# EasyEDA Pro project _SHA-PCB V1.1  30 23_2024-08-26.epro, board PCB1
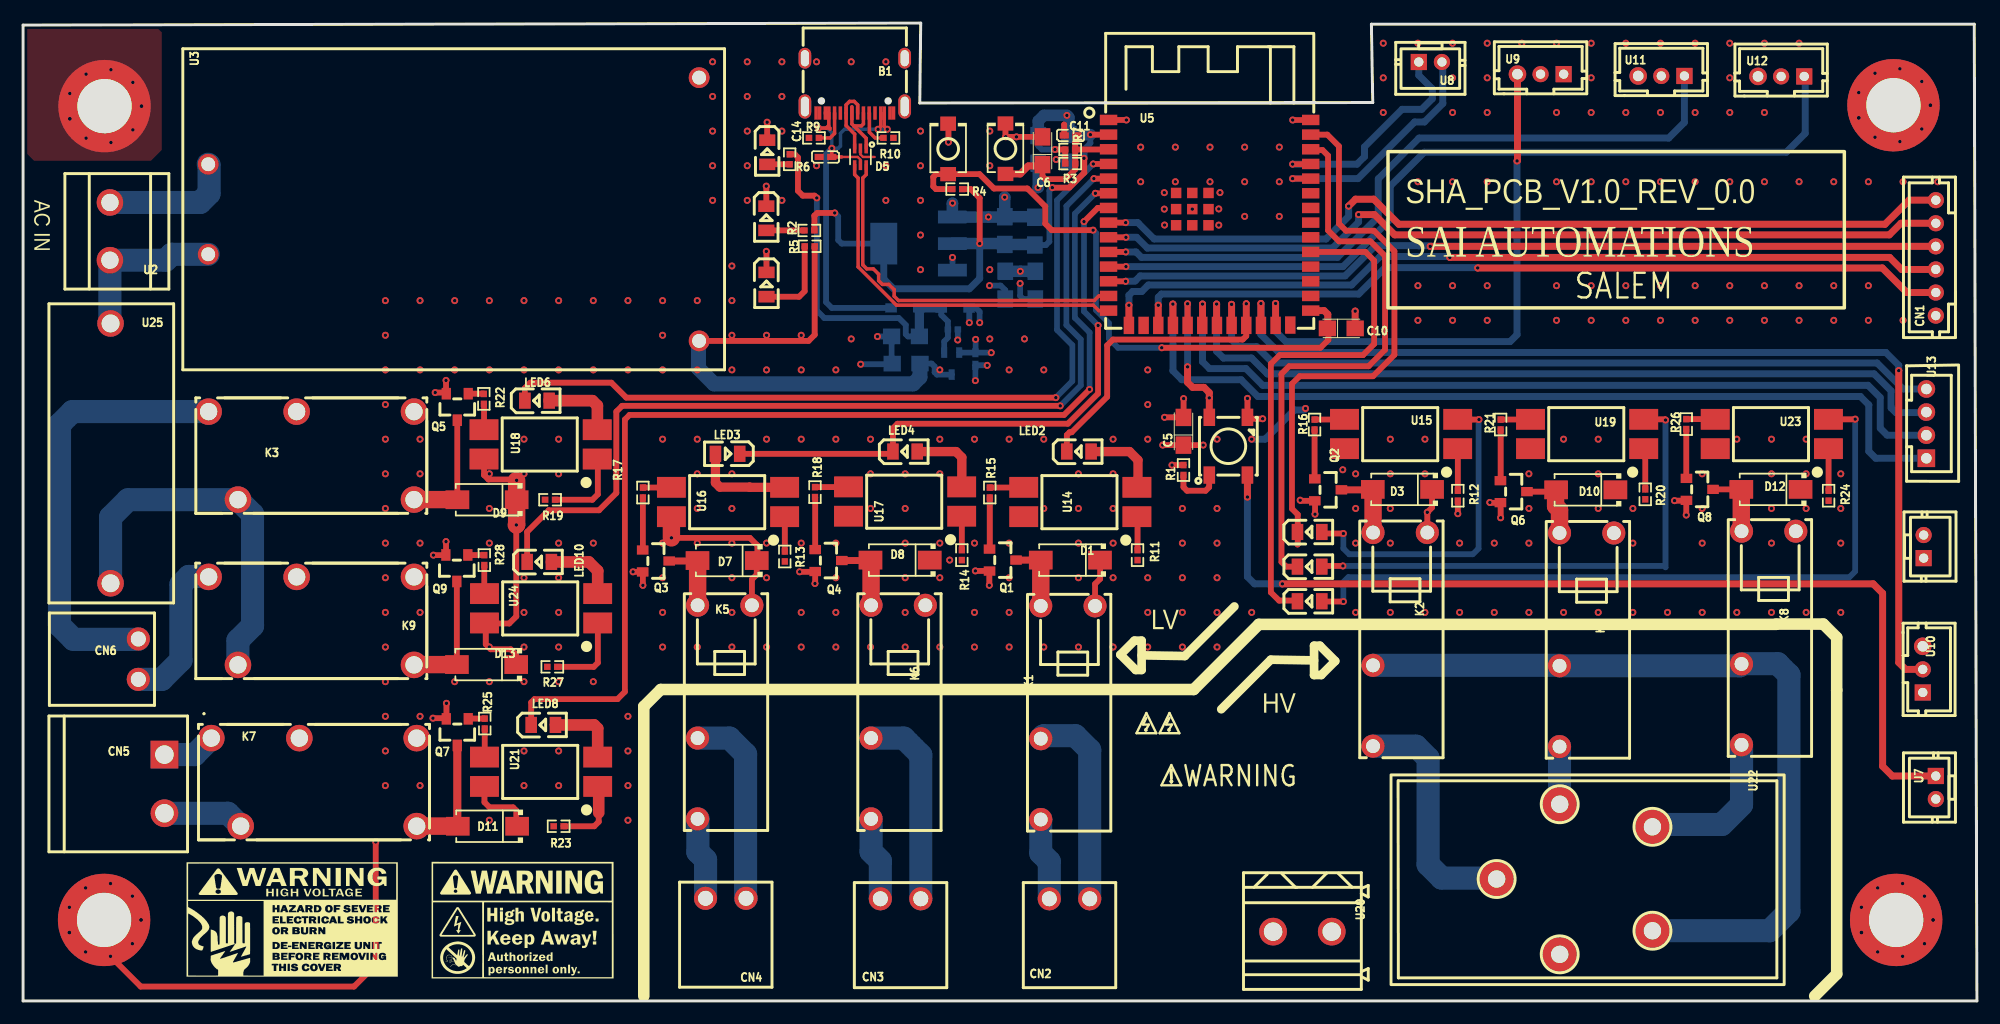
[diagram p2: board, top side]
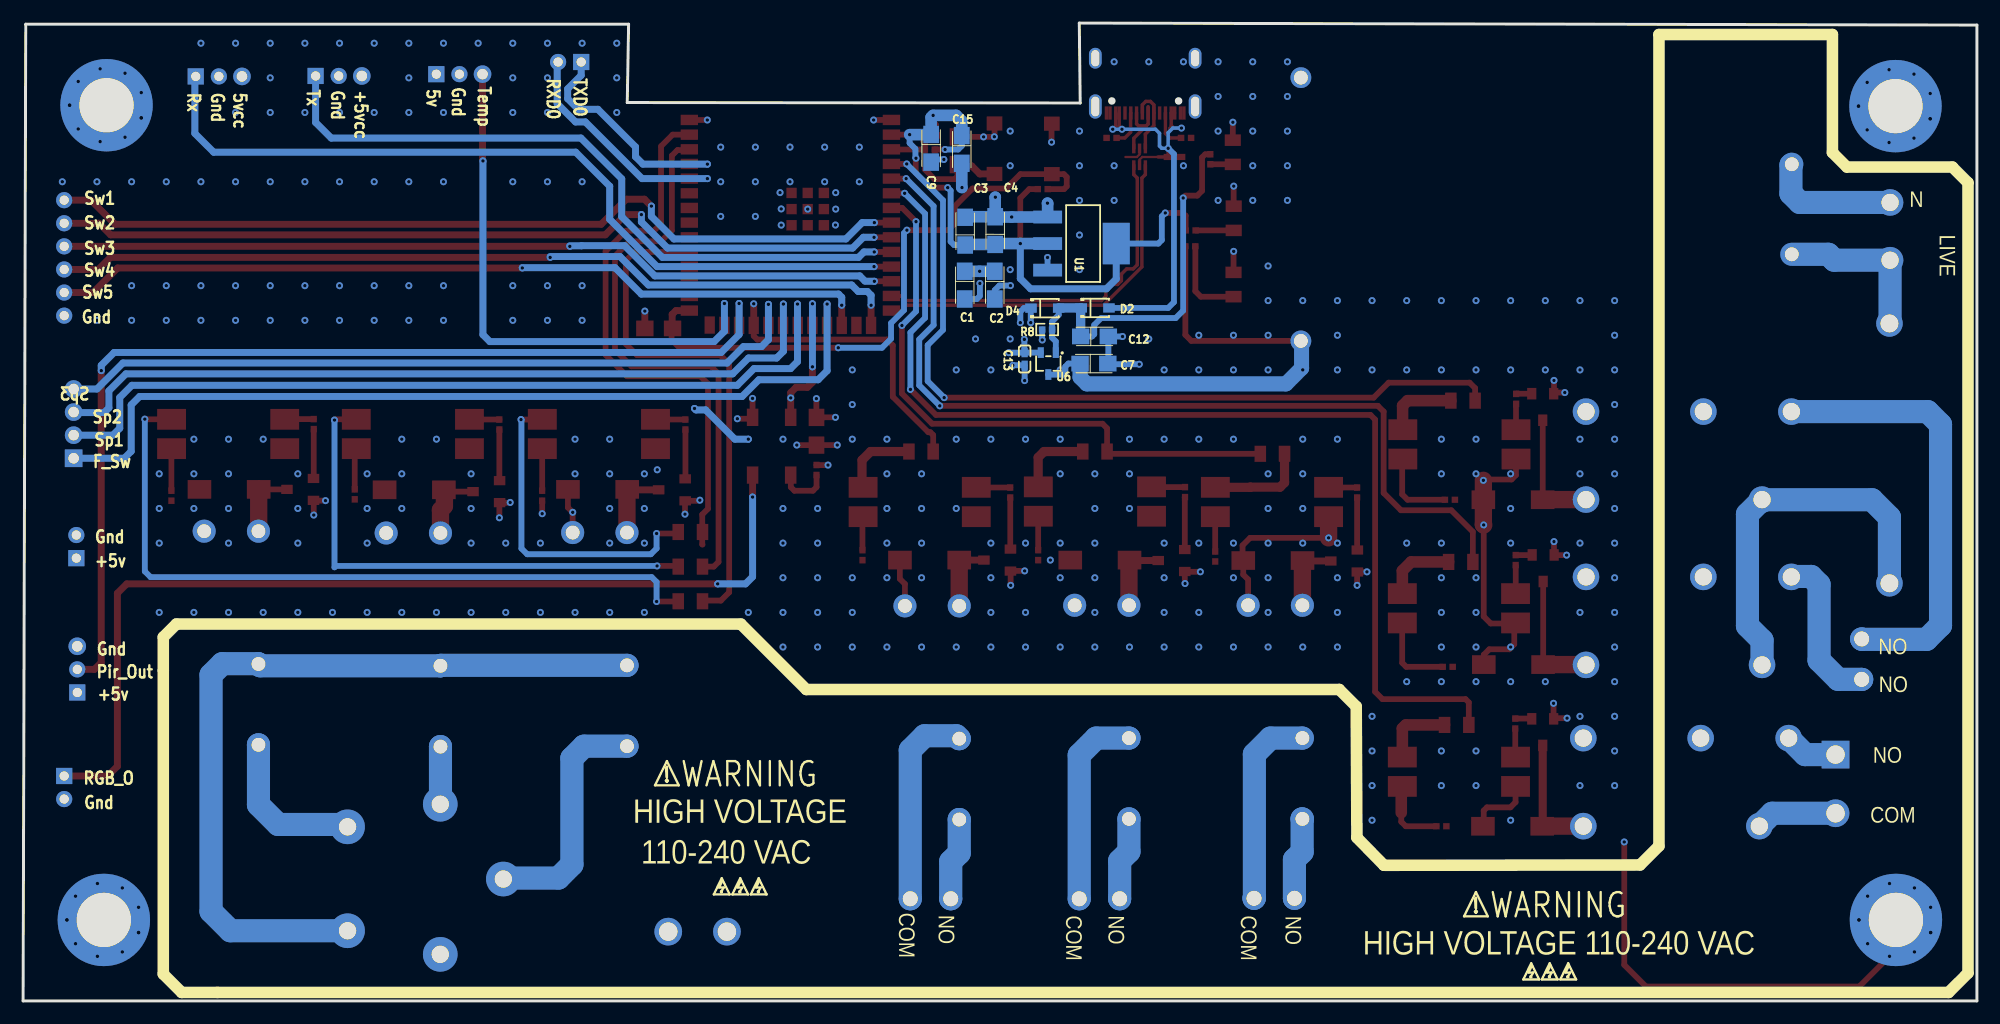
[diagram p3: board, bottom side, seen from below]

Outline 169.15 x 84.68 mm; copper layers: Top Layer, GND, VCC, Bottom Layer. Coordinates in mm from the lower left corner of the outline.
Outline path: 0,84.51 77.71,84.68 77.63,77.76 116.84,77.8 116.73,84.58 168.92,84.58 169.15,0 0,0 0,84.51
Stack: Top Layer 0.035mm 外层铜厚1oz / Dielectric1 0.6133mm 7628 RC49% 8.6mil / GND 0.035mm 内层铜厚 / Dielectric2 0.6133mm 1.1mm H/HOZ 含铜 / VCC 0.035mm 内层铜厚 / Dielectric3 0.6133mm 7628 RC49% 8.6mil / Bottom Layer 0.035mm 外层铜厚1oz

## Design rules (mm)
net D+: D
net D-: D
net DN: DP
net DP: DP
template: Custom Config
spacing copperThickness1oz (default): track to track 0.102, other pairs 0.152 to 0.3
spacing copperThickness2oz: track to track 0.203, other pairs 0.152 to 0.3
spacing copperThicknessInner0.5oz: track to track 0.089, other pairs 0.152 to 0.3
track width copperThickness1oz (default): min 0.102, default 0.254, max 2.54
track width copperThickness2oz: min 0.203, default 0.254, max 2.54
track width copperThickness0.5oz: min 0.089, default 0.254, max 2.54
differential pair differentialPair (default): width min 0.127, default 0.254, max 2.54; gap min 0.152, default 0.152
via viaSize (default): diameter min 0.3, default 0.61, max 10; hole min 0.2, default 0.305, max 6.3
['net', 'd+'] ['NET', 'D-'] uses copperThickness1oz

## Placement (name value [footprint] x y rotation side)
B1  USB_2.1  [TYPE-C-SMD_SBC-160S1A-20-S412]  72 79.27 180 top
C1  10uF  [CASE-A_3216]  87.63 61.99 270 bottom
C2  100nF  [CASE-A_3216]  85.03 61.99 270 bottom
C3  100nF  [CASE-A_3216]  87.59 66.66 90 bottom
C4  10uF  [CASE-A_3216]  84.99 66.71 90 bottom
C5  100nF  [CASE-A_3216]  100.46 49.33 90 top
C6  100nF  [CASE-A_3216]  88.25 73.63 90 top
C7  10uF  [CASE-A_3216]  76.44 55.19 180 bottom
C9  100nF  [CASE-A_3216]  90.54 73.84 270 bottom
C10  100nF  [CASE-A_3216]  114.12 58.24 0 top
C11  1uF  [C0402]  90.68 74.95 180 top
C12  10uF  [CASE-A_3216]  76.39 57.54 180 bottom
C13  1uF  [C0402]  82.44 55.59 270 bottom
C14  1uF  [C0402]  69.47 73.09 180 top
C15  10uF  [CASE-A_3216]  87.89 73.74 270 bottom
CN1  SWITCH IN  [CONN-TH_B6B-PH-K-S-GW]  165.59 64.34 270 top
CN2  XY2500R-G-3.5-2P  [CONN-TH_XY2500R-G-3.5-2P]  90.59 8.85 0 top
CN3  XY2500R-G-3.5-2P  [CONN-TH_XY2500R-G-3.5-2P]  75.97 8.85 0 top
CN4  XY2500R-G-3.5-2P  [CONN-TH_XY2500R-G-3.5-2P]  60.83 8.88 0 top
CN5  10A  [CONN-TH_2P-P5.08_XY2500R-D5.08-2P]  12.24 18.79 270 top
CN6  10A  [CONN-TH_XY2500R-G-3.5-2P]  9.98 29.59 270 top
D1  -  [SMA_L4.4-W2.8-LS5.4-RD]  90.67 38.17 180 top
D2  SD103AWS  [SOD-323_L1.8-W1.3-LS2.5-FD]  76.34 60.01 0 bottom
D3  -  [SMA_L4.4-W2.8-LS5.4-RD]  119.41 44.3 180 top
D4  SD103AWS  [SOD-323_L1.8-W1.3-LS2.5-FD]  80.69 59.99 0 bottom
D5  USBLC6-2P6  [SOT-666-6_L1.6-W1.2-P0.50-LS1.6-BR]  72.49 73.1 90 top
D7  -  [SMA_L4.4-W2.8-LS5.4-RD]  60.95 38.14 180 top
D8  -  [SMA_L4.4-W2.8-LS5.4-RD]  75.93 38.17 180 top
D9  -  [SMA_L4.4-W2.8-LS5.4-RD]  40.16 43.4 180 top
D10  -  [SMA_L4.4-W2.8-LS5.4-RD]  135.29 44.26 180 top
D11  -  [SMA_L4.4-W2.8-LS5.4-RD]  40.2 15.12 180 top
D12  -  [SMA_L4.4-W2.8-LS5.4-RD]  151.32 44.3 180 top
D13  -  [SMA_L4.4-W2.8-LS5.4-RD]  40.12 29.13 180 top
K1  ALDP105W  [RELAY-TH_ALDP1XXW]  90.45 24.96 270 top
K2  ALDP105W  [RELAY-TH_ALDP1XXW]  119.22 31.31 270 top
K3  ALQ105  [RELAY-TH_ALQ1XX]  24.95 47.22 180 top
K4  ALDP105W  [RELAY-TH_ALDP1XXW]  135.37 31.27 270 top
K5  ALDP105W  [RELAY-TH_ALDP1XXW]  60.74 25.01 270 top
K6  ALDP105W  [RELAY-TH_ALDP1XXW]  75.76 25.01 270 top
K7  ALQ105  [RELAY-TH_ALQ1XX]  25.19 18.95 180 top
K8  ALDP105W  [RELAY-TH_ALDP1XXW]  151.12 31.43 270 top
K9  ALQ105  [RELAY-TH_ALQ1XX]  24.95 32.91 180 top
LED1  RGB  [LED-SMD_4P-L5.0-W5.0-BL_TC5050RGB]  104.34 48.04 90 top
LED2  KT-0805Y  [LED0805-R-RD]  91.41 47.57 0 top
LED3  KT-0805Y  [LED0805-R-RD]  60.99 47.38 180 top
LED4  KT-0805Y  [LED0805-R-RD]  76.36 47.57 0 top
LED5  LOW  [LED0805-R-RD]  111.38 40.61 0 top
LED6  KT-0805Y  [LED0805-R-RD]  44.49 51.98 0 top
LED7  MED  [LED0805-R-RD]  111.38 37.61 0 top
LED8  KT-0805Y  [LED0805-R-RD]  45.04 23.9 0 top
LED9  HIGH  [LED0805-R-RD]  111.38 34.61 0 top
LED10  KT-0805Y  [LED0805-R-RD]  44.69 38.02 0 top
LED11  3V3  [LED0805-R-RD]  64.34 67.78 270 top
LED12  EXT_5V  [LED0805-R-RD]  64.36 62.04 270 top
LED13  USB_5V  [LED0805-R-RD]  64.42 73.49 270 top
NOREF  -  [Pad_e207]  7.05 77.49 0 top
NOREF#2  -  [Pad_e24]  7.01 7.01 0 top
NOREF#3  -  [Pad_e195]  161.93 77.57 0 top
NOREF#4  -  [Pad_e183]  162.16 7.01 0 top
Q1  BC547B A1G  [SOT-23_L2.9-W1.3-P1.90-LS2.4-BR]  84.82 38.17 180 top
Q2  BC547B A1G  [SOT-23_L2.9-W1.3-P1.90-LS2.4-BR]  112.98 44.26 180 top
Q3  BC547B A1G  [SOT-23_L2.9-W1.3-P1.90-LS2.4-BR]  54.79 38.1 180 top
Q4  BC547B A1G  [SOT-23_L2.9-W1.3-P1.90-LS2.4-BR]  69.73 38.14 180 top
Q5  BC547B A1G  [SOT-23_L2.9-W1.3-P1.90-LS2.4-BR]  37.59 51.44 90 top
Q6  BC547B A1G  [SOT-23_L2.9-W1.3-P1.90-LS2.4-BR]  129.05 44.1 180 top
Q7  BC547B A1G  [SOT-23_L2.9-W1.3-P1.90-LS2.4-BR]  37.59 23.28 90 top
Q8  BC547B A1G  [SOT-23_L2.9-W1.3-P1.90-LS2.4-BR]  145.15 44.3 180 top
Q9  BC547B A1G  [SOT-23_L2.9-W1.3-P1.90-LS2.4-BR]  37.55 37.47 90 top
R1  3.3kΩ  [R0402]  100.46 45.97 270 top
R2  3.3kΩ  [R0402]  68.07 66.72 0 top
R3  100kΩ  [R0402]  90.65 72.51 0 top
R4  100kΩ  [R0402]  80.87 70.3 0 top
R5  3.3kΩ  [R0402]  68.1 65.35 180 top
R6  3.3kΩ  [R0402]  66.37 72.89 270 top
R7  10kΩ  [R0402]  90.65 73.73 180 top
R8  100kΩ  [R0402]  80.49 58.14 180 bottom
R9  5.1kΩ  [R0402]  68.47 74.74 0 top
R10  5.1kΩ  [R0402]  74.92 74.74 0 top
R11  1kΩ  [R0402]  96.48 38.6 270 top
R12  1kΩ  [R0402]  124.21 43.75 270 top
R13  1kΩ  [R0402]  65.94 38.49 270 top
R14  1kΩ  [R0402]  81.27 38.6 270 top
R15  1kΩ  [R0402]  83.69 44.02 270 top
R16  1kΩ  [R0402]  111.81 49.91 270 top
R17  1kΩ  [R0402]  53.66 44.02 270 top
R18  1kΩ  [R0402]  68.56 44.06 270 top
R19  1kΩ  [R0402]  45.62 43.4 180 top
R20  1kΩ  [R0402]  140.44 43.87 270 top
R21  1kΩ  [R0402]  127.92 49.91 270 top
R22  1kΩ  [R0402]  39.89 52.14 90 top
R23  1kΩ  [R0402]  46.36 15.12 180 top
R24  1kΩ  [R0402]  156.31 43.75 270 top
R25  1kΩ  [R0402]  39.97 24.02 90 top
R26  1kΩ  [R0402]  143.98 49.95 270 top
R27  1kΩ  [R0402]  45.82 28.93 180 top
R28  1kΩ  [R0402]  39.93 38.17 90 top
SW1  EN  [SW-SMD_L3.9-W3.0-P4.45]  85.05 73.8 90 top
SW2  BOOT  [SW-SMD_L3.9-W3.0-P4.45]  80.09 73.78 90 top
U1  AMS1117-3.3  [SOT-223-3_L6.4-W3.5-P2.30-LS7.0-BR]  77.48 65.59 0 bottom
U2  XY126V-5.0-2P  [CONN-TH_XY126V-5.0-2P]  7.52 66.65 90 top
U3  HLK-10M05  [PWRM-TH_HLK-10M05]  37.28 68.56 0 top
U4  5v_OUT  [CONN-TH_2P-P2.00_2B-PH-KL]  164.54 39.34 270 top
U5  ESP32-S3-WROOM-1-N4R8  [WIRELM-SMD_ESP32-S3-WROOM-1]  102.72 67.39 0 top
U6  CJ3139KDW-ES  [SOT-323-3_L2.1-W1.3-P1.30-LS2.3-BR]  80.39 55.19 90 bottom
U7  RBG  [CONN-TH_2P-P2.00_2B-PH-KL]  165.59 18.48 90 top
U8  UART  [CONN-TH_2P-P2.00_2B-PH-KL]  121.83 81.31 180 top
U9  TEMP  [3 PIN JST PH]  130.37 80.26 180 top
U10  PIR  [3 PIN JST PH]  164.46 29.71 90 top
U11  IR_TX  [3 PIN JST PH]  140.83 80.1 180 top
U12  IR_RX  [3 PIN JST PH]  151.2 80.06 180 top
U13  FAN SW  [JST 4PIN]  164.77 49.99 90 top
U14  PC817C-MS  [SOP-4_L6.5-W4.6-P2.54-LS10.0]  91.53 43.21 90 top
U15  PC817C-MS  [SOP-4_L6.5-W4.6-P2.54-LS10.0]  119.3 49.1 90 top
U16  PC817C-MS  [SOP-4_L6.5-W4.6-P2.54-LS10.0]  61.03 43.21 90 top
U17  PC817C-MS  [SOP-4_L6.5-W4.6-P2.54-LS10.0]  76.36 43.24 90 top
U18  PC817C-MS  [SOP-4_L6.5-W4.6-P2.54-LS10.0]  44.8 48.2 90 top
U19  PC817C-MS  [SOP-4_L6.5-W4.6-P2.54-LS10.0]  135.4 49.1 90 top
U20  Fan IN  [CONN-TH_2P-P5.08_DB128L-5.08-2P]  110.75 6 180 top
U21  PC817C-MS  [SOP-4_L6.5-W4.6-P2.54-LS10.0]  44.84 19.84 90 top
U22  -  [REG 1]  119.06 19.06 270 top
U23  PC817C-MS  [SOP-4_L6.5-W4.6-P2.54-LS10.0]  151.4 49.1 90 top
U24  PC817C-MS  [SOP-4_L6.5-W4.6-P2.54-LS10.0]  44.84 34 90 top
U25  0.5A 250 VAC Slow  [TH_2P-BLX-A]  7.57 47.42 270 top

## Footprints (pads in the part's own frame, mm; a bottom-side part is the same pattern mirrored in y, then rotated)
3 PIN JST PH
  rect 1.4x1.4 hole 0.8: 1(-3,0)
  round 1.4 hole 0.8: 2(-1,0)
  round 1.524 hole 0.914: 3(1,0)
C0402
  rect 0.79x0.54 smd: 1(-0.545,0) 2(0.545,0)
CASE-A_3216
  rect 1.5x1.359 smd: 1(-1.2,0) 2(1.2,0)
CONN-TH_2P-P2.00_2B-PH-KL
  rect 1.4x1.4 hole 0.8: 1(1,0)
  round 1.4 hole 0.8: 2(-1,0)
CONN-TH_2P-P5.08_DB128L-5.08-2P
  round 2.4 hole 1.6: 1(-2.54,0) 2(2.54,0)
CONN-TH_2P-P5.08_XY2500R-D5.08-2P
  rect 2.4x2.4 hole 1.6: 1(-2.54,0)
  round 2.4 hole 1.6: 2(2.54,0)
CONN-TH_B6B-PH-K-S-GW
  round 1.4 hole 0.8: 1(-5,0) 2(-3,0) 3(-1,0) 4(1,0) 5(3,0) 6(5,0)
CONN-TH_XY126V-5.0-2P
  round 2.3 hole 1.5: 1(-2.5,0) 2(2.5,0)
CONN-TH_XY2500R-G-3.5-2P
  round 2 hole 1.3: 1(-1.75,0) 2(1.75,0)
JST 4PIN
  rect 1.524x1.524 hole 0.914: 1(-3,0)
  round 1.524 hole 0.914: 2(-1,0) 3(1,0) 4(3,0)
LED0805-R-RD
  rect 1x1.399 smd: 1(1.05,0) 2(-1.05,0)
LED-SMD_4P-L5.0-W5.0-BL_TC5050RGB
  rect 1.5x1 smd: 1(-2.5,1.65) 2(-2.5,-1.65) 3(2.5,-1.65) 4(2.5,1.65)
Pad_e24
  round 8 hole 4.7: 42(0,0)
Pad_e183
  round 8 hole 4.7: 42(0,0)
Pad_e195
  round 8 hole 4.7: 42(0,0)
Pad_e207
  round 8 hole 4.7: 42(0,0)
PWRM-TH_HLK-10M05
  round 1.8 hole 1.2: 1(-21.25,3.9) 2(-21.25,-3.9) 3(21.25,11.4) 4(21.25,-11.4)
R0402
  rect 0.566x0.54 smd: 1(-0.433,0) 2(0.433,0)
REG 1
  round 3 hole 1.5: 1(15.032,13.97) 2(8.509,8.509) 3(2.032,13.97) 4(3.988,21.997) P(12.988,21.997)
RELAY-TH_ALDP1XXW
  round 2 hole 1.2: 1(-9.25,-2.35) 2(2.25,-2.35) 3(9.25,-2.35) 4(-9.25,2.35)
RELAY-TH_ALQ1XX
  round 2.3 hole 1.5: 1(-8.89,-3.81) 2(1.27,-3.81) 3(8.89,-3.81) 4(6.35,3.81) 5(-8.89,3.81)
SMA_L4.4-W2.8-LS5.4-RD
  rect 2.046x1.62 smd: 1(-2.566,0) 2(2.566,0)
SOD-323_L1.8-W1.3-LS2.5-FD
  rect 1x0.8 smd: 1(-1.2,0) 2(1.2,0)
SOP-4_L6.5-W4.6-P2.54-LS10.0
  rect 1.8x2.5 smd: 1(-1.27,-4.9) 2(1.27,-4.9) 3(1.27,4.9) 4(-1.27,4.9)
SOT-23_L2.9-W1.3-P1.90-LS2.4-BR
  rect 1x0.8 smd: 1(1.15,-0.95) 2(1.15,0.95) 3(-1.15,0)
SOT-223-3_L6.4-W3.5-P2.30-LS7.0-BR
  rect 2.5x1.1 smd: 1(2.97,-2.3) 2(2.97,0) 3(2.97,2.3)
  rect 2.34x3.6 smd: 4(-2.97,0)
SOT-323-3_L2.1-W1.3-P1.30-LS2.3-BR
  rect 0.919x0.525 smd: 1(0.95,-0.65) 2(0.95,0.65) 3(-0.95,0)
SOT-666-6_L1.6-W1.2-P0.50-LS1.6-BR
  rect 0.85x0.3 smd: 1(0.725,-0.5) 2(0.725,0) 3(0.725,0.5) 4(-0.725,0.5) 5(-0.725,0) 6(-0.725,-0.5)
SW-SMD_L3.9-W3.0-P4.45
  rect 1.23x1.36 smd: 1(-2.185,0) 2(2.185,0)
TH_2P-BLX-A
  round 2.3 hole 1.55: 1(-11.25,0) 2(11.25,0)
TYPE-C-SMD_SBC-160S1A-20-S412
  oval 1.1x2.1 hole 0.7x1.7: 1(-4.32,1.807) 1(4.32,1.807)
  oval 1.1x1.8 hole 0.7x1.4: 1(-4.32,-2.373) 1(4.32,-2.373)
  rect 0.3x1.15 smd: A1(-3.35,2.372) A4(-2.55,2.372) A5(-1.25,2.372) A6(-0.25,2.372) A7(0.25,2.372) A8(1.25,2.373) A9(2.55,2.373) A12(3.35,2.372) B1(3.05,2.372) B4(2.25,2.373) B5(1.75,2.372) B6(0.75,2.372) B7(-0.75,2.372) B8(-1.75,2.373) B9(-2.25,2.372) B12(-3.05,2.372)
WIRELM-SMD_ESP32-S3-WROOM-1
  rect 1.5x0.9 smd: 1(-8.75,8.895) 2(-8.75,7.625) 3(-8.75,6.355) 4(-8.75,5.085) 5(-8.75,3.815) 6(-8.75,2.545) 7(-8.75,1.275) 8(-8.75,0.005) 9(-8.75,-1.265) 10(-8.75,-2.535) 11(-8.75,-3.805) 12(-8.75,-5.075) 13(-8.75,-6.345) 14(-8.75,-7.615) 27(8.75,-7.615) 28(8.75,-6.345) 29(8.75,-5.075) 30(8.75,-3.805) 31(8.75,-2.535) 32(8.75,-1.265) 33(8.75,0.005) 34(8.75,1.275) 35(8.75,2.545) 36(8.75,3.815) 37(8.75,5.085) 38(8.75,6.355) 39(8.75,7.625) 40(8.75,8.895)
  rect 0.9x1.5 smd: 15(-6.985,-8.895) 16(-5.715,-8.895) 17(-4.445,-8.895) 18(-3.175,-8.895) 19(-1.905,-8.895) 20(-0.635,-8.895) 21(0.635,-8.895) 22(1.905,-8.895) 23(3.175,-8.895) 24(4.445,-8.895) 25(5.715,-8.895) 26(6.985,-8.865)
  rect 0.9x0.9 smd: 41(-2.9,2.575) 41(-2.9,1.175) 41(-2.9,-0.225) 41(-1.5,2.575) 41(-1.5,1.175) 41(-1.5,-0.225) 41(-0.1,2.575) 41(-0.1,1.175) 41(-0.1,-0.225)

## Nets
As in the schematic, except:
GND: B1.1 B1.A1 B1.A12 B1.B1 B1.B12 C1.2 C2.2 C3.2 C4.2 C5.2 C6.2 C7.2 C9.2 C10.2 C11.2 C12.2 C13.2 C14.2 C15.2 CN1.6 D5.2 LED1.3 LED11.2 LED12.2 LED13.2 NOREF.42 NOREF#2.42 NOREF#3.42 NOREF#4.42 Q1.2 Q2.2 Q3.2 Q4.2 Q5.2 Q6.2 Q7.2 Q8.2 Q9.2 R8.1 R9.1 R10.2 SW1.2 SW2.2 U1.1 U3.3 U4.2 U5.1 U5.40 U5.41 U7.2 U9.2 U10.3 U11.2 U12.2
FIN: K2.2 K4.2 K8.2 U22.P
N: U2.2 U3.1
$1N98744: U2.1 U3.2 U25.1

Pads without a net: B1 A8 B8; K3 2; K7 2; K9 2; U5 16 26 28 29 30 32 33 34 35; U20 1 2; U22 1

## Via types
v1: diameter 0.61, hole 0.304, Top Layer to Bottom Layer, 331 vias
v2: diameter 0.61, hole 0.305, Top Layer to Bottom Layer, 168 vias

## Routing (per net, layer and track width the routed paths; a pad name or vN(x,y) marks a point on that pad's centre or on a via; arc(x,y) is an arc through that point)
+3V3: length 65.1
  Top Layer w0.5: U5.2 v2(92.4,75.02) ; v2(70.27,68.24) 68.75,68.24 68.51,68 68.5,68 R2.2 ; R4.2 82.04,70.3 82.82,69.53 v2(82.82,65.59) ; R3.1 R7.2 v2(89.33,73.73) ; v2(89.1,70.43) 90.58,70.43 91.87,71.73 91.87,72.95 v2(91.85,72.97)
  Bottom Layer w0.5: v2(89.1,70.43) 88.85,70.18 88.85,65.76 88.55,65.46 C3.1 ; v2(92.4,75.02) 92.4,74.29 91.9,73.78 91.9,73.02 v2(91.85,72.97) ; v2(89.33,73.73) 88.2,73.73 87.88,74.05 87.88,75.59 87.89,75.6 ; U1.4 70.87,65.59 70.57,65.89 70.57,67.94 v2(70.27,68.24)
  Bottom Layer w0.6: v2(82.82,65.59) 82.82,62.56 81.92,61.67 75.36,61.67 74.51,62.52 U1.4
  Bottom Layer w1: v2(92.4,75.02) 90.6,75.02 90.54,75.09 90.54,76.52 v2(90.37,76.69) 88.37,76.69 87.89,76.21 C15.1 ; U1.2 v2(82.82,65.59) 84.91,65.59 C4.1 87.54,65.51 C3.1
+5VCC: length 15.4
  Top Layer w0.5: v2(99.47,46.4) 100.45,46.4 R1.1 ; v2(102.16,48.14) 102.16,48.13 C5.1 100.45,48.14 v2(98.67,48.14)
  Bottom Layer w0.5: v2(83.82,56.14) 83.81,56.14 C13.1 ; 80.46,64.38 80.46,63.29 U1.3 ; U6.2 82.44,56.14 C13.1 ; v2(81.92,58.74) 81.92,59.97 D4.2 82.51,59.99 82.82,59.69 v2(82.82,58.74) ; C13.1 82.47,56.16 v2(82.47,57.29)
  Bottom Layer w1: C2.1 v2(86.34,63.19) C1.1
  vias: v2(80.46,64.38)
GND: length 108
  Top Layer w0.2: D5.2 72.49,73.31 72.72,73.09 73.72,73.09
  Top Layer w0.5: 127.92,43.13 Q6.2 ; 127.92,43.13 v2(127.92,41.84) ; 127.92,43.13 127.01,43.13 v2(126.98,43.17) ; U5.1 95.51,76.29 v2(95.52,76.29) ; LED13.2 64.42,76.09 v2(64.41,76.1) ; v2(67.23,37.16) 68.55,37.16 Q4.2 68.58,36.17 v2(68.56,36.15) ; v2(36.65,25.77) 36.65,24.44 Q7.2 36.58,24.49 v2(35.48,24.49) ; v2(52.81,37.16) 53.63,37.16 Q3.2 53.66,37.13 v2(53.66,35.99) ; v2(35.52,38.6) 36.58,38.6 Q9.2 36.61,38.64 v2(36.61,39.77) ; v2(143.98,42.07) 143.98,43.33 ; 143.98,43.33 143.98,43.32 v2(142.97,43.32) ; 143.98,43.33 Q8.2 ; LED12.2 64.36,64.9 v2(64.34,64.91) ; v2(106,52.18) 106,50.54 ; C11.2 90.13,75.88 90.12,75.89 ; v2(83.65,35.99) 83.65,37.2 Q1.2 83.66,37.24 v2(82.44,37.24) ; v2(35.68,52.68) 36.54,52.68 36.61,52.61 ; v2(111.85,42.15) 111.85,43.29 Q2.2 110.61,43.31 v2(110.56,43.36) ; 106,50.54 106.12,50.42 v2(107.31,50.42) ; 36.61,52.61 v2(36.61,53.74) ; 36.61,52.61 Q5.2 ; LED11.2 64.34,70.55 v2(64.34,70.56) ; v2(100.47,52.16) 100.47,50.54 100.46,50.53 100.45,50.54 v2(98.82,50.54) ; v2(30.53,13.76) 30.53,3.12 28.65,1.24 10.19,1.24 v2(7.57,3.86) ; SW2.2 80.11,75.94 v2(80.11,74.37) ; U5.40 111.47,76.29 v2(109.92,76.29) ; 85.05,75.98 85.05,74.86 v2(85.07,74.84) 85.07,74.83 v2(86,74.83) C6.2
  Top Layer w0.6: C10.2 v2(115.32,59.74)
  Bottom Layer w0.5: C9.2 90.3,72.87 v2(89.43,72.87) ; 75.19,55.24 C12.2 75.18,57.54 v2(73.97,57.54) ; v2(83.67,61.95) 84.63,61.95 85.03,61.55 C2.2 ; v2(80.92,57.24) 80.92,57.25 R8.1 ; C1.2 87.63,60.78 86.58,60.78 86.32,61.05 v2(86.32,62.14) ; 75.19,55.14 75.18,55.14 v2(72.52,55.14) ; v2(83.47,55.04) 83.45,55.05 C13.2 v2(82.44,53.72)
  Bottom Layer w1: v2(87.87,70.44) 87.89,70.46 87.89,71.88 ; v2(80.47,69.09) 80.45,69.07 U1.1 v2(83.56,67.89) 84.97,67.89 ; v2(84.98,69.6) 84.99,69.59 84.99,67.96 84.97,67.94 ; 87.64,67.91 C4.2
  vias: v1(59.69,81.33) v1(59.69,78.33) v1(59.69,75.33) v1(59.69,72.33) v1(59.69,69.33) v1(62.69,81.33) v1(62.69,78.33) v1(62.69,75.33) v1(62.69,72.33) v1(62.69,69.33) v1(65.69,81.33) v1(65.69,78.33) v1(65.69,75.33) v1(65.69,69.33) v1(68.69,81.33) v1(68.69,72.33) v1(71.69,81.33) v1(71.69,57.33) v1(74.69,81.33) v1(74.69,72.33) v1(74.69,69.33) v1(77.69,75.33) v1(77.69,72.33) v1(77.69,69.33) v1(77.69,66.33) v1(77.69,63.33) v1(83.69,75.33) v1(83.69,72.33) v1(83.69,63.33) v1(83.69,57.33) v1(86.69,57.33) v1(96.75,73.94) v1(96.75,70.94) v1(99.75,73.94) v1(99.75,70.94) v1(102.75,73.94) v1(102.75,70.94) v1(105.75,73.94) v1(105.75,70.94) v1(105.75,67.94) v1(108.75,73.94) v1(108.75,70.94) v1(108.75,67.94) v1(117.75,82.94) v1(117.75,79.94) v1(117.75,76.94) v1(120.75,82.94) v1(120.75,70.94) v1(120.75,61.94) v1(120.75,58.94) v1(123.75,82.94) v1(123.75,79.94) v1(123.75,76.94) v1(123.75,70.94) v1(123.75,61.94) v1(123.75,58.94) v1(126.75,82.94) v1(126.75,79.94) v1(126.75,76.94) v1(126.75,70.94) v1(126.75,61.94) v1(126.75,58.94) v1(129.75,82.94) v1(132.75,82.94) v1(132.75,76.94) v1(132.75,70.94) v1(132.75,61.94) v1(132.75,58.94) v1(135.75,82.94) v1(135.75,79.94) v1(135.75,76.94) v1(135.75,70.94) v1(135.75,61.94) v1(135.75,58.94) v1(138.75,82.94) v1(138.75,76.94) v1(138.75,70.94) v1(138.75,61.94) v1(138.75,58.94) v1(141.75,82.94) v1(141.75,76.94) v1(141.75,70.94) v1(141.75,61.94) v1(141.75,58.94) v1(144.75,82.94) v1(144.75,76.94) v1(144.75,70.94) v1(144.75,61.94) v1(144.75,58.94) v1(147.75,82.94) v1(147.75,79.94) v1(147.75,76.94) v1(147.75,70.94) v1(147.75,61.94) v1(147.75,58.94) v1(150.75,82.94) v1(150.75,76.94) v1(150.75,70.94) v1(150.75,61.94) v1(150.75,58.94) v1(153.75,82.94) v1(153.75,70.94) v1(153.75,61.94) v1(153.75,58.94) v1(156.75,70.94) v1(156.75,61.94) v1(156.75,58.94) v1(159.75,70.94) v1(159.75,61.94) v1(159.75,58.94) v1(162.75,70.94) v1(162.75,58.94) v1(165.75,70.94) v2(4,8.11) v2(4,5.92) v2(4,5.92) v2(4.04,78.58) v2(4.04,76.39) v2(4.04,76.39) v2(5.41,9.78) v2(5.41,4.24) v2(5.45,80.26) v2(5.45,74.72) v2(7.6,80.64) v2(7.6,74.34) v2(7.57,10.16) v2(9.5,79.55) v2(9.5,75.43) v2(9.46,9.07) v2(9.46,4.96) v2(10.21,7.01) v2(10.21,7.01) v2(10.25,77.49) v2(10.25,77.49) v2(98.8,70) v2(98.8,68.57) v2(98.82,67.19) v2(101.22,68.57) v2(103.52,68.59) v2(103.52,67.19) v2(103.62,70) v2(158.92,78.66) v2(158.92,76.47) v2(158.92,76.47) v2(159.15,8.11) v2(159.15,5.92) v2(159.15,5.92) v2(160.33,80.34) v2(160.33,74.79) v2(160.56,9.78) v2(160.56,4.24) v2(162.48,80.72) v2(162.48,74.41) v2(162.71,10.16) v2(162.71,3.86) v2(164.38,79.62) v2(164.38,75.51) v2(164.61,9.07) v2(164.61,4.96) v2(165.12,77.57) v2(165.12,77.57) v2(165.36,7.01) v2(165.36,7.01)
VBUS: length 37.8
  Top Layer w0.2: 70.87,73.09 72.26,73.09 72.49,72.85 D5.5
  Top Layer w0.3: v2(68.87,75.59) 69.52,75.59 ; 69.52,75.59 69.85,75.59 69.85,75.49 ; 69.52,75.59 69.75,75.82 B1.B4 B1.A9 ; B1.A4 74.55,75.75 v2(74.82,75.49) ; v2(74.02,75.49) 74.25,75.72 B1.B9 ; 70.87,73.09 C14.1 70.02,73.09 v2(70.02,73.84)
  Bottom Layer w0.3: v2(68.87,75.59) 69.62,75.59 70.02,75.19 v2(70.02,73.84) 70.57,73.84 70.77,74.04 70.77,75.14 71.12,75.49 v2(74.02,75.49) v2(74.82,75.49)
  Bottom Layer w0.5: D2.1 70.02,60.01 69.52,60.51 69.52,73.34 v2(70.02,73.84)
AR1: length 71.8
  Top Layer w0.5: LED6.2 43.44,53.06 43.92,53.54 50.93,53.54 52.22,52.24 v2(89.41,52.24) ; v2(92.65,72.48) U5.4
  Bottom Layer w0.5: v2(92.65,72.48) 89.51,69.34 89.51,58.11 90.83,56.79 90.83,53.67 v2(89.41,52.24)
AR2: length 94.7
  Top Layer w0.5: v2(92.33,52.96) 90.12,50.75 52.5,50.75 52.1,50.34 52.1,26.77 51.46,26.13 44.27,26.13 43.99,25.85 LED8.2 ; U5.6 v2(92.83,69.94)
  Bottom Layer w0.5: v2(92.33,52.96) 92.33,57.89 91.06,59.16 91.06,68.17 v2(92.83,69.94)
AR3: length 80.6
  Top Layer w0.5: LED10.2 43.64,40.62 45.5,42.49 49.86,42.49 51.36,43.99 51.36,51.03 51.86,51.53 v2(89.79,51.53) ; v2(92.7,71.21) U5.5
  Bottom Layer w0.5: v2(89.79,51.53) 91.57,53.31 91.57,57.29 90.32,58.53 90.32,68.83 v2(92.7,71.21)
AR4: length 25.9
  Top Layer w0.5: U5.23 105.9,57.58 105.59,57.27 94.35,57.27 93.85,56.77 93.85,52.32 90.78,49.25 90.6,49.25 90.36,49.01 LED2.2
  Top Layer w0.6: U5.23 v2(105.9,60.37)
AR5: length 52.4
  Top Layer w0.5: U5.7 93.03,68.67 v2(91.85,67.48) ; LED3.2 75.11,47.38 LED4.2 75.31,49.59 75.7,49.98 90.45,49.98 93.07,52.6 v2(93.07,58.49)
  Bottom Layer w0.5: v2(93.07,58.49) 91.85,59.71 v2(91.85,67.48)
AS1_IN: length 75.9
  Top Layer w0.5: U5.8 v2(95.45,67.4)
  Top Layer w0.6: v2(114.76,68.83) 115.36,69.43 116.93,69.43 119.1,67.26 161.19,67.26 163.28,69.34 CN1.1
  Bottom Layer w0.6: v2(95.45,67.4) 96.5,67.4 97.92,65.99 112.8,65.99 114.76,67.94 v2(114.76,68.83)
AS2_IN: length 74.7
  Top Layer w0.5: U5.9 v2(95.48,66.13)
  Top Layer w0.6: CN1.2 162.57,67.34 161.57,66.34 118.74,66.34 116.99,68.09 v2(115.62,68.09)
  Bottom Layer w0.6: v2(95.48,66.13) 96.4,66.13 97.33,65.2 113.36,65.2 115.62,67.46 v2(115.62,68.09)
AS3_IN: length 72.9
  Top Layer w0.5: U5.12 v2(95.45,62.32)
  Top Layer w0.6: v2(121.82,65.34) CN1.3
  Bottom Layer w0.5: 96.25,62.32 96.3,62.37
  Bottom Layer w0.6: 121.82,65.4 120.81,65.4 120.8,65.4 117.07,65.4 114.45,62.79 96.72,62.79 96.3,62.37 ; v2(95.45,62.32) 96.25,62.32
AS4_IN: length 74.2
  Top Layer w0.6: CN1.4 162.64,63.34 161.59,64.39 v2(123.52,64.39) ; U5.15 v2(95.74,60.25)
  Bottom Layer w0.6: 95.74,60.32 95.74,61.11 96.06,61.44 96.85,61.44 97.41,62 115.01,62 117.47,64.46 123.52,64.46
AS5_IN: length 71.7
  Top Layer w0.6: v2(125.93,63.47) 160.96,63.47 163.09,61.34 CN1.5 ; U5.17 v2(98.28,60.25)
  Bottom Layer w0.6: 125.93,63.5 117.91,63.5 115.62,61.21 98.55,61.21 98.28,60.94 98.28,60.27
COM: length 7.1
  Bottom Layer w2: CN5.2 17.72,16.25 K7.4
D+: length 32.2
  Top Layer w0.3: D5.4 71.99,71.56 72.29,71.26 72.29,63.57 75.61,60.25 92.65,60.25 93.12,59.78 U5.14
D-: length 32.1
  Top Layer w0.3: D5.6 72.99,71.56 72.69,71.26 72.69,63.75 73.04,63.4 73.61,63.4 74.07,62.94 74.07,62.37 74.39,62.05 74.96,62.05 75.41,61.59 75.41,61.03 75.79,60.65 92.73,60.65 93.13,61.05 U5.13
DN: length 6
  Top Layer w0.3: D5.1 72.99,74.7 71.91,75.78 ; B1.B7 72.75,75.95 72.58,75.78 71.91,75.78 ; 71.91,75.78 71.75,75.94 71.75,77.44
DP: length 6
  Top Layer w0.3: D5.3 71.99,75.06 71.25,75.8 B1.B6 71.25,77.6 71.55,77.9 71.95,77.9 72.25,77.6 B1.A6
EN: length 13.7
  Top Layer w0.5: 91.08,74.34 91.22,74.48 91.22,74.95 ; R7.1 R3.2 91.08,72.01 90.25,71.17 88.49,71.17 88.25,71.41 C6.1 ; R7.1 91.09,74.34 ; R7.1 93.95,73.73 U5.3
  Top Layer w0.6: SW1.1 86.33,71.62 87.02,72.31 88.14,72.31 C6.1
EXT_5V: length 105.8
  Top Layer w0.5: U21.4 39.94,17.2 40.39,16.76 42.42,16.76 42.7,16.48 42.7,15.19 D11.1 ; v2(42.7,41.22) 42.7,33.3 42.09,32.69 39.99,32.69 ; K2.4 121.57,42.31 v2(121.56,42.31) 121.98,42.73 D3.1 ; D13.1 42.69,29.98 42.21,30.45 40.49,30.45 40.06,30.88 40.06,32.62 39.99,32.69 ; U3.4 68.01,57.16 68.53,57.68 R5.1 ; U24.4 39.99,32.69 ; 93.23,38.17 93.24,38.17 93.24,36.55 92.8,36.11 K1.4 ; v2(124.21,42.19) R12.2 ; U18.4 39.9,45.54 40.28,45.16 43.05,45.16 43.08,45.13 ; v2(56.13,40.1) 62.92,40.1 63.58,39.44 63.58,38.2 D7.1 63.52,36.92 63.09,36.5 K5.4
  Top Layer w1.5: U16.4 v2(56.13,40.1) ; v2(42.7,41.22) 42.73,41.25 D9.1 v2(42.73,45.08)
  Bottom Layer w0.5: C7.1 78.66,55.19 78.92,54.94 78.92,54.44 79.12,54.24 80.38,54.24 U6.3
  Bottom Layer w0.6: v1(106.36,48.65) 107.53,48.65 110.06,51.18 110.9,51.18 v2(111.02,51.3)
  Bottom Layer w1.3: U3.4 58.47,57.1 58.47,54.79 59.82,53.44 77.07,53.44 77.64,54.01 C7.1
  vias: v1(31.36,60.65) v1(31.36,57.65) v1(31.36,54.65) v1(31.36,51.65) v1(31.36,48.65) v1(31.36,45.65) v1(31.36,42.65) v1(31.36,39.65) v1(31.36,36.65) v1(31.36,33.65) v1(31.36,30.65) v1(31.36,27.65) v1(31.36,24.65) v1(31.36,21.65) v1(31.36,18.65) v1(34.36,60.65) v1(34.36,54.65) v1(34.36,48.65) v1(34.36,45.65) v1(34.36,39.65) v1(34.36,33.65) v1(34.36,24.65) v1(34.36,18.65) v1(37.36,60.65) v1(37.36,54.65) v1(37.36,27.65) v1(40.36,60.65) v1(40.36,54.65) v1(40.36,45.65) v1(40.36,42.65) v1(40.36,39.65) v1(40.36,30.65) v1(40.36,27.65) v1(40.36,15.65) v1(43.36,60.65) v1(43.36,54.65) v1(43.36,48.65) v1(43.36,45.65) v1(43.36,36.65) v1(43.36,33.65) v1(43.36,30.65) v1(43.36,27.65) v1(43.36,21.65) v1(43.36,18.65) v1(46.36,60.65) v1(46.36,54.65) v1(46.36,48.65) v1(46.36,45.65) v1(46.36,39.65) v1(46.36,36.65) v1(46.36,33.65) v1(46.36,30.65) v1(46.36,27.65) v1(46.36,21.65) v1(46.36,18.65) v1(49.36,60.65) v1(49.36,54.65) v1(49.36,39.65) v1(49.36,27.65) v1(52.36,60.65) v1(52.36,54.65) v1(52.36,24.65) v1(52.36,21.65) v1(52.36,18.65) v1(52.36,15.65) v1(55.36,60.65) v1(55.36,57.65) v1(55.36,54.65) v1(55.36,48.65) v1(55.36,39.65) v1(55.36,36.65) v1(55.36,33.65) v1(55.36,30.65) v1(58.36,60.65) v1(58.36,54.65) v1(58.36,48.65) v1(58.36,45.65) v1(58.36,42.65) v1(58.36,39.65) v1(58.36,30.65) v1(61.36,63.65) v1(61.36,60.65) v1(61.36,57.65) v1(61.36,54.65) v1(61.36,45.65) v1(61.36,42.65) v1(61.36,39.65) v1(61.36,36.65) v1(61.36,33.65) v1(61.36,30.65) v1(64.36,57.65) v1(64.36,54.65) v1(64.36,48.65) v1(64.36,39.65) v1(64.36,36.65) v1(64.36,30.65) v1(67.36,57.65) v1(67.36,54.65) v1(67.36,48.65) v1(67.36,39.65) v1(67.36,33.65) v1(67.36,30.65) v1(70.36,54.65) v1(70.36,48.65) v1(70.36,39.65) v1(70.36,36.65) v1(70.36,33.65) v1(70.36,30.65) v1(73.36,48.65) v1(73.36,45.65) v1(73.36,42.65) v1(73.36,30.65) v1(76.36,45.65) v1(76.36,42.65) v1(76.36,39.65) v1(76.36,36.65) v1(76.36,33.65) v1(76.36,30.65) v1(79.36,54.65) v1(79.36,48.65) v1(79.36,45.65) v1(79.36,39.65) v1(79.36,36.65) v1(79.36,30.65) v1(82.36,48.65) v1(82.36,39.65) v1(82.36,33.65) v1(82.36,30.65) v1(85.36,54.65) v1(85.36,48.65) v1(85.36,39.65) v1(85.36,36.65) v1(85.36,33.65) v1(85.36,30.65) v1(88.36,54.65) v1(88.36,48.65) v1(88.36,42.65) v1(88.36,30.65) v1(91.36,45.65) v1(91.36,42.65) v1(91.36,39.65) v1(91.36,36.65) v1(91.36,30.65) v1(94.36,48.65) v1(94.36,45.65) v1(94.36,42.65) v1(94.36,39.65) v1(94.36,36.65) v1(94.36,30.65) v1(97.36,54.65) v1(97.36,51.65) v1(97.36,48.65) v1(97.36,36.65) v1(97.36,33.65) v1(97.36,30.65) v1(100.36,42.65) v1(100.36,39.65) v1(100.36,36.65) v1(100.36,33.65) v1(100.36,30.65) v1(103.36,48.65) v1(103.36,42.65) v1(103.36,39.65) v1(103.36,36.65) v1(103.36,33.65) v1(103.36,30.65) v1(106.36,33.65) v1(115.36,45.65) v1(115.36,42.65) v1(115.36,39.65) v1(115.36,33.65) v1(118.36,48.65) v1(118.36,45.65) v1(118.36,42.65) v1(118.36,39.65) v1(118.36,33.65) v1(121.36,48.65) v1(121.36,45.65) v1(121.36,33.65) v1(124.36,39.65) v1(124.36,33.65) v1(127.36,39.65) v1(127.36,33.65) v1(130.36,45.65) v1(130.36,42.65) v1(130.36,39.65) v1(130.36,33.65) v1(133.36,48.65) v1(133.36,33.65) v1(136.36,48.65) v1(136.36,45.65) v1(136.36,42.65) v1(136.36,33.65) v1(139.36,45.65) v1(139.36,42.65) v1(139.36,39.65) v1(139.36,33.65) v1(142.36,33.65) v1(145.36,45.65) v1(145.36,42.65) v1(145.36,39.65) v1(145.36,33.65) v1(148.36,48.65) v1(148.36,33.65) v1(151.36,48.65) v1(151.36,45.65) v1(151.36,42.65) v1(151.36,39.65) v1(151.36,33.65) v1(154.36,48.65) v1(154.36,45.65) v1(154.36,42.65) v1(154.36,33.65) v1(157.36,45.65) v1(157.36,42.65) v1(157.36,39.65) v1(157.36,33.65) v2(80.22,38.17) v2(114.25,46)
FAN_SW: length 78.3
  Top Layer w0.6: v2(99.54,60.35) 99.54,58.5 U5.18
  Bottom Layer w0.6: U13.1 160.39,46.99 159.79,47.59 159.79,51.61 159.05,52.35 106.9,52.35 105.45,53.79 100.32,53.79 99.54,54.57 v2(99.54,60.35)
FIN: length 69.5
  Bottom Layer w2: K2.2 132.98,29.06 K4.2 148.62,29.02 K8.2 148.8,29.2 151.9,29.2 152.88,28.23 152.88,7.75 151.2,6.08 U22.P
FO1: length 20.9
  Bottom Layer w2: K2.3 120.59,22.06 121.64,21.01 121.64,11.81 122.81,10.64 127.49,10.64 U22.2
FO2: length 5
  Bottom Layer w2: K4.3 133.02,17.05 U22.3
FO3: length 13.7
  Bottom Layer w2: U22.4 141.26,15.28 147.07,15.28 148.77,16.99 K8.3
FSR1: length 48.4
  Top Layer w0.5: 110.33,39.52 110.35,39.54 110.35,42.12 109.85,42.62 109.85,53.44 110.52,54.1 116.87,54.1 118.72,55.95 118.72,64.92 116.94,66.7 114.53,66.7 113.92,67.31 113.92,74.01 112.91,75.02 U5.39
FSR2: length 49.9
  Top Layer w0.5: U5.38 111.54,73.68 112.5,73.68 112.98,73.2 112.98,66.72 113.92,65.78 116.64,65.78 117.91,64.51 117.91,56.38 116.48,54.96 109.6,54.96 108.94,54.3 108.94,38.02 109.35,37.61 LED7.2
FSR3: length 45.1
  Top Layer w0.5: LED9.2 110.27,34.67 108.74,34.67 108.02,35.38 108.02,55.16 108.79,55.93 116,55.93 116.97,56.89 116.97,64.11 116.21,64.86 U5.31
IO0: length 52.8
  Top Layer w0.5: C10.1 113,58.16 113,57.25 112.32,56.56 v2(98.58,56.56) ; R4.1 79.03,70.3 78.8,70.53 78.8,71.35 79.05,71.6 SW2.1 82.8,71.6 84.05,70.35 86.95,70.35 88.49,68.81 88.49,67.31 89.05,66.75 v2(92.63,66.75)
  Top Layer w0.6: C10.1 112.95,58.27 112.95,59.46 112.63,59.78 U5.27
  Bottom Layer w0.5: v2(92.63,66.75) 92.89,66.49 92.89,59.81 94,58.7 94,57.35 94.79,56.56 v2(98.58,56.56)
IR_RX: length 71.7
  Top Layer w0.5: U5.11 v2(95.48,63.59)
  Bottom Layer w0.6: U12.1 154.28,79.98 154.28,75.13 152.65,73.5 121.31,73.5 118.36,70.56 118.36,67.69 114.27,63.59 v2(95.48,63.59)
IR_TX: length 60.8
  Top Layer w0.5: U5.10 v2(95.46,64.86)
  Bottom Layer w0.6: v2(95.46,64.86) 96.35,64.86 96.82,64.39 113.79,64.39 117.32,67.92 117.32,71.19 120.85,74.72 142.47,74.72 143.83,76.08 U11.1
N: length 11.5
  Bottom Layer w2: U2.2 15.32,69.15 16.1,69.92 16.1,72.38 U3.1
NO1: length 38.1
  Bottom Layer w2: CN6.1 9.94,31.31 4.36,31.31 3.15,32.52 3.15,49.91 4.27,51.03 K3.3
NO2: length 13.6
  Bottom Layer w2: 16.02,36.76 14.36,36.76 13.67,36.07 13.67,29.5 12.01,27.84 CN6.2
NO3: length 4.6
  Bottom Layer w2: K7.3 14.87,21.33 CN5.1
P: length 32.7
  Bottom Layer w2: K9.4 18.6,31.22 19.86,32.48 19.86,42.15 K3.4 18.59,43.4 9.09,43.4 7.57,41.88 U25.2
PIR: length 89
  Top Layer w0.6: U10.2 162.98,28.71 162.38,29.31 v2(162.38,54.58) ; U5.24 107.16,58.5 v2(107.16,60.4)
  Bottom Layer w0.6: v2(107.16,60.4) 107.16,57.71 108.71,56.16 161.26,56.16 162.38,55.04 v2(162.38,54.58)
RGB: length 13.1
  Top Layer w0.5: U5.19 100.82,60.37 v2(100.81,60.37)
  Top Layer w0.6: v2(100.81,54.91) 100.81,53.57 101.24,53.13 102.23,53.13 102.69,52.68 v2(102.69,52.22) 102.69,52.22 LED1.4
  Bottom Layer w0.6: v2(100.81,54.91) v2(100.81,60.37)
RGB_O: length 84.3
  Top Layer w0.6: U7.1 161.82,19.48 160.99,20.32 160.99,35.3 160.17,36.12 v2(109.02,36.12) ; LED1.2 v2(105.99,43.63)
  Bottom Layer w0.6: v2(105.99,43.63) 105.99,36.73 106.6,36.12 v2(109.02,36.12)
RS2: length 73.7
  Top Layer w0.6: v2(102.11,60.35) 102.11,58.52 U5.20
  Bottom Layer w0.6: U13.2 161.38,48.99 160.78,49.59 160.78,52.25 159.72,53.31 107.31,53.31 105.87,54.76 102.71,54.76 102.11,55.36 v2(102.11,60.35)
RS3: length 70.5
  Top Layer w0.6: U5.21 103.33,58.53 v2(103.33,60.35)
  Bottom Layer w0.6: U13.3 164.73,50.95 162.13,50.95 161.72,51.36 161.72,52.83 160.25,54.3 107.72,54.3 106.35,55.67 103.91,55.67 103.33,56.26 v2(103.33,60.35)
RS4: length 66.8
  Top Layer w0.6: U5.22 104.62,58.5 v2(104.62,60.32)
  Bottom Layer w0.6: v2(104.62,60.32) 104.62,57.26 105.22,56.66 106.78,56.66 108.2,55.24 160.5,55.24 162.75,52.99 U13.4
RXD0: length 20.9
  Top Layer w0.5: U5.36 v2(109.91,71.21)
  Bottom Layer w0.6: v2(109.91,71.21) 115.56,71.21 120.47,76.12 121.32,76.12 122.91,77.71 122.91,81.23 U8.2
TMP: length 48.4
  Top Layer w0.6: U5.25 108.43,58.5 v2(108.43,60.4) ; U9.3 129.37,72.78 v2(129.34,72.74)
  Bottom Layer w0.6: v2(129.34,72.74) 129.34,57.7 128.74,57.1 109.32,57.1 108.43,57.98 v2(108.43,60.4)
TXD0: length 20.2
  Top Layer w0.5: U5.37 111.45,72.46 v2(109.91,72.46)
  Bottom Layer w0.6: v2(109.91,72.46) 115.48,72.46 116.13,73.11 116.13,73.96 119.38,77.21 121.08,77.21 122,78.13 122,78.98 120.83,80.15 U8.1
$1N19522: length 7.4
  Top Layer w0.5: 67.66,65.35 67.66,61.46 67.18,60.98 64.36,60.98 LED12.1
$1N20222: length 1.9
  Top Layer w0.5: R6.2 64.43,72.45 LED13.1
$1N20581: length 34.3
  Top Layer w0.5: v2(68.72,69.54) 68.52,69.74 67.5,69.74 67.08,70.15 67.08,73.05 66.81,73.32 66.37,73.32
  Bottom Layer w0.5: v2(68.72,69.54) 68.72,59.79 69.37,59.14 75.82,59.14 76.42,58.54 76.42,57.74 76.61,57.54 C12.1 ; U6.1 79.74,57.11 80.07,57.44 80.07,58.14 R8.2 80.07,58.15 80.07,58.84 79.49,59.41 D4.1
  Bottom Layer w0.8: D4.1 79.47,60.01 D2.2 77.59,59.96 C12.1
$1N21974: length 3.3
  Top Layer w0.5: LED11.1 67.61,66.73
$1N22604: length 4.6
  Top Layer w0.5: LED1.1 102.68,45.52 102.68,44.49 102.37,44.18 100.77,44.18 100.46,44.49 R1.2
$1N26423: length 3.3
  Top Layer w0.3: R9.2 69.87,74.74 70.25,75.12 B1.B5
$1N26495: length 3.1
  Top Layer w0.3: B1.A5 73.27,76.88 73.27,75.24 73.77,74.74 R10.1
$1N98744: length 14.2
  Bottom Layer w2: U25.1 7.52,58.72 U2.1 12.35,64.15 12.86,64.66 U3.2
$2N6425: length 6.4
  Top Layer w1: U18.2 49.72,49.48 49.72,51.55 49.29,51.98 LED6.1
$2N6428: length 7
  Top Layer w0.5: R19.1 49.29,43.4 49.76,43.87 49.76,46.88 U18.1
$2N6430: length 2.2
  Top Layer w0.5: U18.3 39.9,51.69 R22.1
$2N7885: length 6.8
  Top Layer w0.8: U14.2 96.52,44.57 96.52,46.83 95.78,47.57 LED2.1
$2N7886: length 2.9
  Top Layer w0.5: U14.1 96.48,41.88 R11.1
$2N7887: length 2.9
  Top Layer w0.5: U14.3 86.61,44.46 R15.1
$2N7888: length 4.5
  Top Layer w0.5: Q1.1 83.69,39.14 R15.2
$2N18449: length 1.4
  Top Layer w0.5: Q5.1 39.87,52.59 R22.2
$2N18487: length 10.6
  Top Layer w0.5: 37.59,50.29 37.59,43.41 D9.2
  Top Layer w1.5: K3.5 37.59,43.41
$2N18765: length 6.1
  Top Layer w0.6: Q1.3 D1.2
  Top Layer w1.5: K1.1 D1.2
$2N18786: length 17.7
  Bottom Layer w2: CN2.2 92.34,21.72 91.1,22.96 88.36,22.96 K1.2
$2N22813: length 63.8
  Top Layer w0.5: v2(158.61,50.38) 158.59,50.37 156.3,50.37 ; v2(114.3,34.59) 112.45,34.59 LED9.1
  Bottom Layer w0.5: v2(114.3,34.59) 114.3,36.27 114.73,36.7 158.11,36.7 158.61,37.2 v2(158.61,50.38)
$2N22814: length 3.6
  Top Layer w0.5: U23.1 156.31,47.81 R24.1
$2N22817: length 2.5
  Top Layer w0.5: 146.5,50.37 146.47,50.39 R26.1
$2N22820: length 4.3
  Top Layer w0.5: R26.2 143.98,45.27 Q8.1
$2N22829: length 6.1
  Top Layer w0.5: Q8.3 D12.2
  Top Layer w1.5: D12.2 148.75,40.7 K8.1
$2N24231: length 44.5
  Top Layer w0.5: v2(114.27,37.67) 112.49,37.67 LED7.1 ; v2(142.19,50.3) 142.13,50.37 140.3,50.37
  Bottom Layer w0.5: v2(114.27,37.67) 142.07,37.67 142.19,37.55 v2(142.19,50.3)
$2N24232: length 3.6
  Top Layer w0.5: U19.1 140.44,47.69 R20.1
$2N24235: length 2.6
  Top Layer w0.5: R21.1 130.49,50.35 130.5,50.37
$2N24238: length 4.4
  Top Layer w0.5: 127.92,49.48 127.92,45.07 Q6.1
$2N24250: length 6.4
  Top Layer w0.5: 132.67,44.21 132.57,44.1 Q6.3
  Top Layer w1.5: K4.1 133.02,42.51 132.67,42.85 132.67,44.21 D10.2
$2N24525: length 28.4
  Top Layer w0.5: v2(114.3,40.48) 112.56,40.48 LED5.1 ; v2(126.04,50.34) 124.22,50.34 124.2,50.37
  Bottom Layer w0.5: 126.04,50.38 126,50.34 126,39.18 125.5,38.68 114.8,38.68 114.3,39.18 v2(114.3,40.48)
$2N24526: length 3.6
  Top Layer w0.5: R12.1 124.21,47.81 U15.1
$2N24529: length 2.6
  Top Layer w0.5: R16.1 114.38,50.35 114.4,50.37
$2N24532: length 4.3
  Top Layer w0.5: 111.81,49.48 111.81,45.23 Q2.1
$2N24544: length 6.5
  Top Layer w0.6: D3.2 116.81,44.26 Q2.3
  Top Layer w1.5: K2.1 116.87,44.28 D3.2
$2N25145: length 6.3
  Top Layer w1: U21.2 49.74,23.6 49.44,23.9 LED8.1
$2N25148: length 6.3
  Top Layer w0.5: R23.1 49.44,15.12 49.83,15.51 49.83,16.29
  Top Layer w1: 49.83,16.29 49.83,18.48 U21.1
$2N25151: length 2.5
  Top Layer w0.5: U21.3 39.97,21.14 R25.1
$2N25161: length 1.4
  Top Layer w0.5: Q7.1 38.56,24.45 R25.2
$2N25163: length 10.6
  Top Layer w0.7: Q7.3 37.59,15.17 37.62,15.14
  Top Layer w1.5: K7.5 37.62,15.14 D11.2
$2N25822: length 6.3
  Top Layer w1: LED10.1 48.98,38.02 49.74,37.25 U24.2
$2N25825: length 7.1
  Top Layer w0.5: 46.25,28.93 49.41,28.93 49.76,29.28 49.76,32.72 U24.1
$2N25828: length 2.4
  Top Layer w0.5: U24.3 39.93,35.29 39.93,37.7
$2N25838: length 1.4
  Top Layer w0.5: Q9.1 38.51,38.61 39.93,38.61
$2N25840: length 10.9
  Top Layer w0.5: Q9.3 37.55,29.13 D13.2
  Top Layer w1.5: D13.2 33.87,29.13 K9.5
$2N26115: length 8.7
  Top Layer w0.8: U16.2 62.92,44.48 62.9,44.49 60.33,44.49 59.94,44.88 59.94,47.38
$2N26116: length 3
  Top Layer w0.5: 65.94,38.92 65.94,41.92 U16.1
$2N26119: length 2.5
  Top Layer w0.5: R17.1 56.11,44.46 U16.3
$2N26122: length 4.6
  Top Layer w0.5: R17.2 53.66,39.07 Q3.1
$2N26131: length 6.3
  Top Layer w0.6: D7.2 58.35,38.1 Q3.3
  Top Layer w1.5: K5.1 58.4,38.13 D7.2
$2N47435: length 6.6
  Top Layer w0.8: LED4.1 80.76,47.57 81.27,47.07 81.27,44.53 U17.2
$2N47436: length 2.9
  Top Layer w0.5: U17.1 81.27,41.96 R14.1
$2N47437: length 2.9
  Top Layer w0.5: R18.1 71.44,44.5 U17.3
$2N47438: length 4.6
  Top Layer w0.5: Q4.1 68.58,43.61 R18.2
$2N47446: length 6.4
  Top Layer w0.6: D8.2 73.32,38.14 Q4.3
  Top Layer w1.5: D8.2 73.41,38.13 K6.1
$2N52895: length 17.2
  Bottom Layer w2: CN4.2 62.55,8.92 62.55,21.36 61.15,22.76 58.43,22.76
$2N52927: length 7.2
  Bottom Layer w2: CN4.1 59.08,12.23 58.41,12.9 58.41,15.74 58.43,15.76
$2N65724: length 7.2
  Bottom Layer w2: K1.3 88.1,12.81 88.84,12.07 CN2.1
$2N65899: length 17.4
  Bottom Layer w2: K6.2 76.25,22.76 77.72,21.29 CN3.2
$2N65904: length 7.3
  Bottom Layer w2: K6.3 73.41,12.93 74.22,12.13 CN3.1

## Copper pours and planes (outline as drawn; the poured copper is in the pictures)
+5VCC on VCC: 0.26,84.42 168.89,84.42 168.89,0.26 0.26,0.26
GND on Top Layer: 0.36,84.17 12.01,84.17 12.01,72.77 0.36,72.77
GND on Top Layer: 167.89,12.19 168.76,11.33 168.76,0.38 158.3,0.38 157.59,1.17 157.59,11.35 158.42,12.19
GND on Top Layer: 157.28,84.15 168.48,84.15 168.48,72.77 167.82,72.11 157.58,72.11 156.72,72.97 156.72,83.58
GND on Top Layer: 98.35,70.83 104.05,70.83 104.05,66.45 98.35,66.45
GND on Top Layer: 10.36,11.66 11.96,10.06 11.96,0.99 11.35,0.38 0.36,0.38 0.36,10.75 1.27,11.66
GND on Top Layer: 117.22,77.57 116.84,77.19 91.74,77.19 90.75,76.2 90.75,56.24 91.06,55.94 168.16,55.94 168.63,56.41 168.63,71.73 168.48,71.88 157.5,71.88 156.51,72.87 156.51,84.15 156.39,84.27 117.55,84.27 117.22,83.94
GND on Top Layer: 69.29,57.15 69.29,66.67 68.96,67 57.1,67 56.69,67.41 56.69,84.38 56.74,84.43 77.24,84.43 77.44,84.22 77.44,77.64 77.62,77.47 90.27,77.47 90.63,77.11 90.63,59 88.24,56.61 77.01,56.61 76.58,56.18 76.58,54.45 76.45,54.33 72.48,54.33 72.16,54.65 72.16,56.44 71.83,56.77 69.67,56.77
GND on GND: 0.26,84.42 168.89,84.42 168.89,0.26 0.26,0.26
GND on GND: 0.26,11.93 12.27,11.93 12.27,0.26 0.26,0.26
EXT_5V on Top Layer: 78.28,56.49 79.07,55.7 167.21,55.7 167.74,55.17 167.74,33.98 166.98,33.22 106.73,33.22 101.55,28.04 55.02,28.04 52.78,25.8 52.78,14.7 50.72,12.65 29.66,12.65 28.36,13.95 28.36,60.75 29.23,61.62 60.71,61.62 60.88,61.79 60.88,65.73 61.24,66.09 68.79,66.09 69.04,65.83 69.04,57.02 69.52,56.54 71.63,56.54 71.93,56.23 71.93,54.51 72.31,54.12 76.47,54.12 76.76,54.41 76.76,56.11 77.14,56.49

## Text on the board
Bottom Silkscreen Layer: Sp3 | +5v | Gnd | Pir_Out | Sp1 | F_Sw | Sp2 | Sw1 | Sw2 | Sw3 | Sw4 | RGB_O | Sw5 | TXD0 | RXD0 | Temp | 5v | +5vcc | Tx | 5vcc | Rx | N | NO | COM | ⚡⚡⚡ | LIVE | ⚠WARNING | HIGH VOLTAGE 110-240 VAC | HIGH VOLTAGE / 110-240 VAC
Top Silkscreen Layer: SALEM | LV | HV | AC IN | ⚡⚡ | ⚠WARNING | SHA_PCB_V1.0_REV_0.0 | SAI AUTOMATIONS
